# EAGLE design Lipo-Charger-5V-setup_RevC (EAGLE 8.2.1)
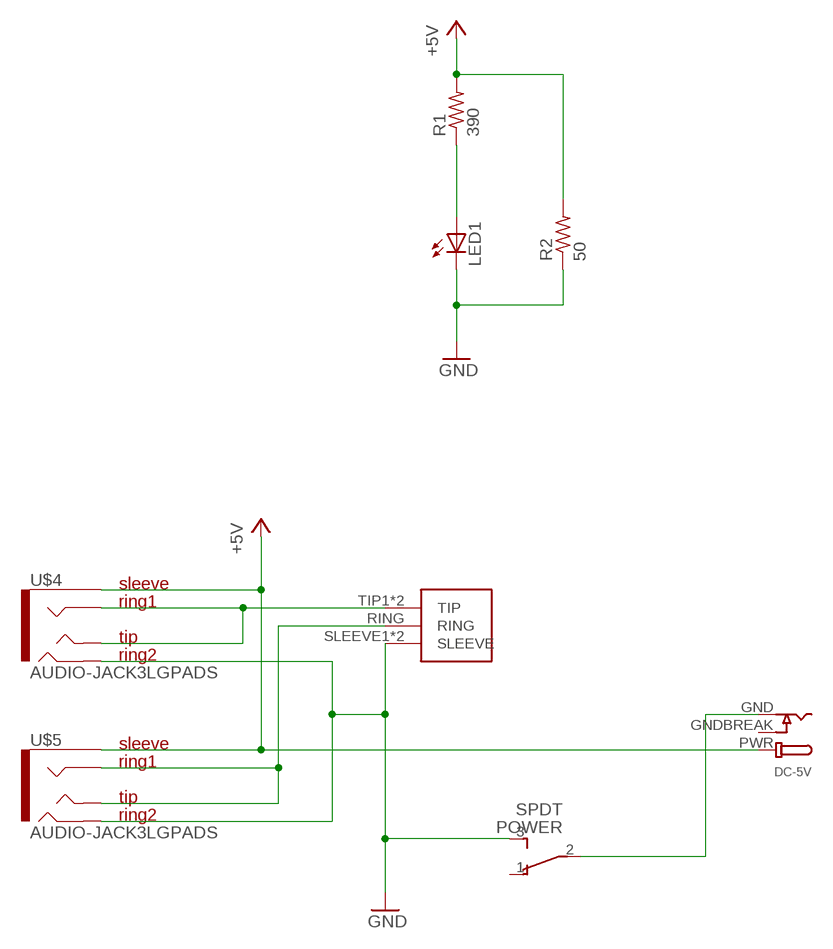
[diagram p0: schematic, sheet 1]

## Parts
AUDIO_OUT  1/8"-F-STEREO-PCB  [1/8"-F-STEREO-PCB]
DC-5V  DCBARRELPTH  [DCJACK_2MM_PTH]
LED1  LED3MM  [LED3MM]
POWER  SPDT  SWITCH_SPDTTE-CONNECT  [SWITCH_SPDT-TE-CONNECT]
R1  390  R-US_0204/7  [0204/7]
R2  50  R-US_0204/7  [0204/7]
U$4  AUDIO-JACK3LGPADS  [AUDIO-JACK-TRRS-SMD]
U$5  AUDIO-JACK3LGPADS  [AUDIO-JACK-TRRS-SMD]

## Nets
+5V: DC-5V.PWR R1.2 R2.2 U$4.EARTH U$5.EARTH
GND: AUDIO_OUT.SLEEVE1(SLEEVE) AUDIO_OUT.SLEEVE2(SLEEVE) LED1.K(C) POWER.3 R2.1 U$4.RING2 U$5.RING2
N$2: LED1.A R1.1
N$4: DC-5V.GND POWER.2
N$8: AUDIO_OUT.RING U$5.RING1 U$5.TIP
OUT2: AUDIO_OUT.TIP1(TIP) AUDIO_OUT.TIP2(TIP) U$4.RING1 U$4.TIP
Unconnected: POWER.1

## Power pins joined to a net without a drawn wire
GNDBREAK: DC-5V.GNDBREAK

## Library data of the parts
AUDIO_OUT = CMU-ArtFab:1/8"-F-STEREO-PCB
DC-5V = microbuilder:DCBARREL: DC Barrel Jack DCJACK_1.3MM_PTH - Through Hole 1.3mm Jack (4UConnector: 05536) DCJACK_2MM_PTH - Through Hole 2.0/2.1 Jack (4UConnector: 05537) DCJACK_2MM_SMT - SMT 2.0/2.1mm Jack(4UConnector: 03267)
LED1 = led:LED: LED OSRAM: - CHIPLED LG R971, LG N971, LY N971, LG Q971, LY Q971, LO R971, LY R971 LH N974, LH R974 LS Q976, LO Q976, LY Q976 LO Q996 - Hyper CHIPLED LW Q18S LB Q993, LB Q99A, LB R99A - SideLED LS A670, LO A670, LY A670, LG A670, LP A670 LB A673, LV A673, LT A673, LW A673 LH A674 LY A675 LS A676, LA A676, LO A676, LY A676, LW A676 LS A679, LY A679, LG A679 - Hyper Micro SIDELED® LS Y876, LA Y876, LO Y876, LY Y876 LT Y87S - SmartLED LW L88C, LW L88S LB L89C, LB L89S, LG L890 LS L89K, LO L89K, LY L89K LS L896, LA L896, LO L896, LY L896 - TOPLED LS T670, LO T670, LY T670, LG T670, LP T670 LSG T670, LSP T670, LSY T670, LOP T670, LYG T670 LG T671, LOG T671, LSG T671 LB T673, LV T673, LT T673, LW T673 LH T674 LS T676, LA T676, LO T676, LY T676, LB T676, LH T676, LSB T676, LW T676 LB T67C, LV T67C, LT T67C, LS T67K, LO T67K, LY T67K, LW E67C LS E67B, LA E67B, LO E67B, LY E67B, LB E67C, LV E67C, LT E67C LW T67C LS T679, LY T679, LG T679 LS T770, LO T770, LY T770, LG T770, LP T770 LB T773, LV T773, LT T773, LW T773 LH T774 LS E675, LA E675, LY E675, LS T675 LS T776, LA T776, LO T776, LY T776, LB T776 LHGB T686 LT T68C, LB T68C - Hyper Mini TOPLED® LB M676 - Mini TOPLED Santana® LG M470 LS M47K, LO M47K, LY M47K Source: http://www.osram.convergy.de LUXEON: - LUMILED® LXK2-PW12-R00, LXK2-PW12-S00, LXK2-PW14-U00, LXK2-PW14-V00 LXK2-PM12-R00, LXK2-PM12-S00, LXK2-PM14-U00 LXK2-PE12-Q00, LXK2-PE12-R00, LXK2-PE12-S00, LXK2-PE14-T00, LXK2-PE14-U00 LXK2-PB12-K00, LXK2-PB12-L00, LXK2-PB12-M00, LXK2-PB14-N00, LXK2-PB14-P00, LXK2-PB14-Q00 LXK2-PR12-L00, LXK2-PR12-M00, LXK2-PR14-Q00, LXK2-PR14-R00 LXK2-PD12-Q00, LXK2-PD12-R00, LXK2-PD12-S00 LXK2-PH12-R00, LXK2-PH12-S00 LXK2-PL12-P00, LXK2-PL12-Q00, LXK2-PL12-R00 Source: www.luxeon.com KINGBRIGHT: KA-3528ASYC Source: www.kingbright.com
POWER = CMU-ArtFab:SWITCH_SPDT
R1 R2 = CMU-ArtFab:R-US_: RESISTOR, American symbol
U$4 U$5 = CMU-ArtFab:AUDIO-JACK3: Audio jack - 3.5mm TRRS variety - two rings.

## Board
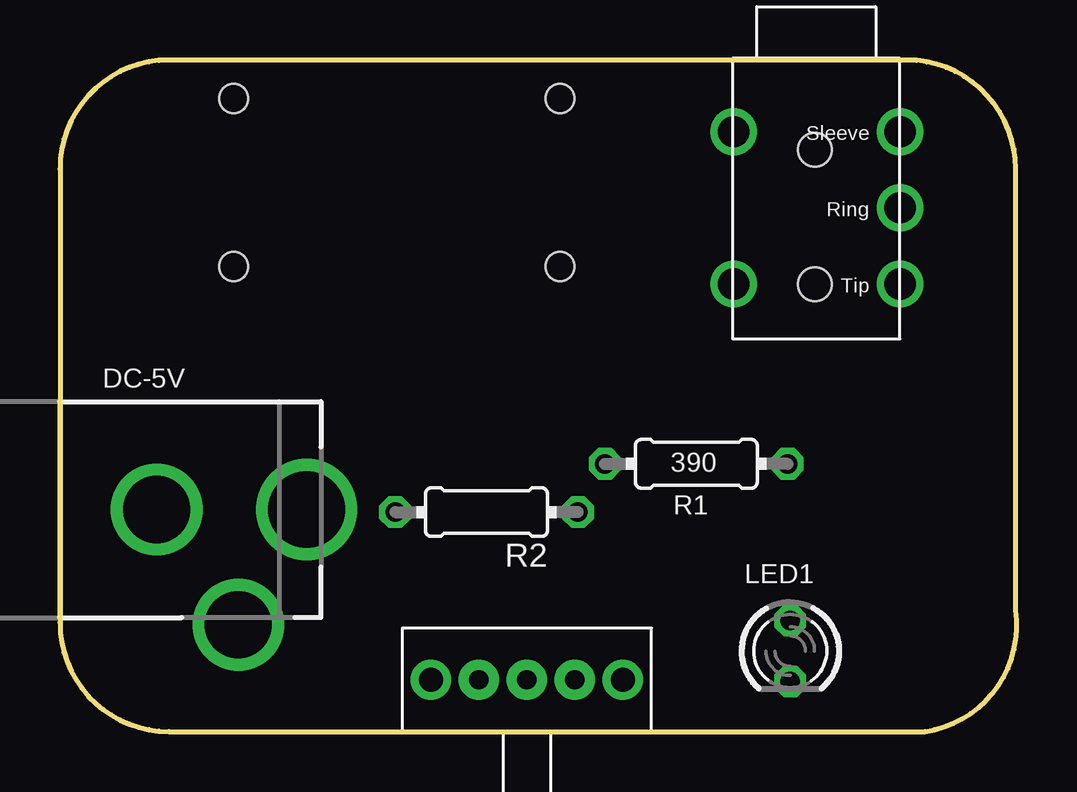
[diagram p1: board, top side]
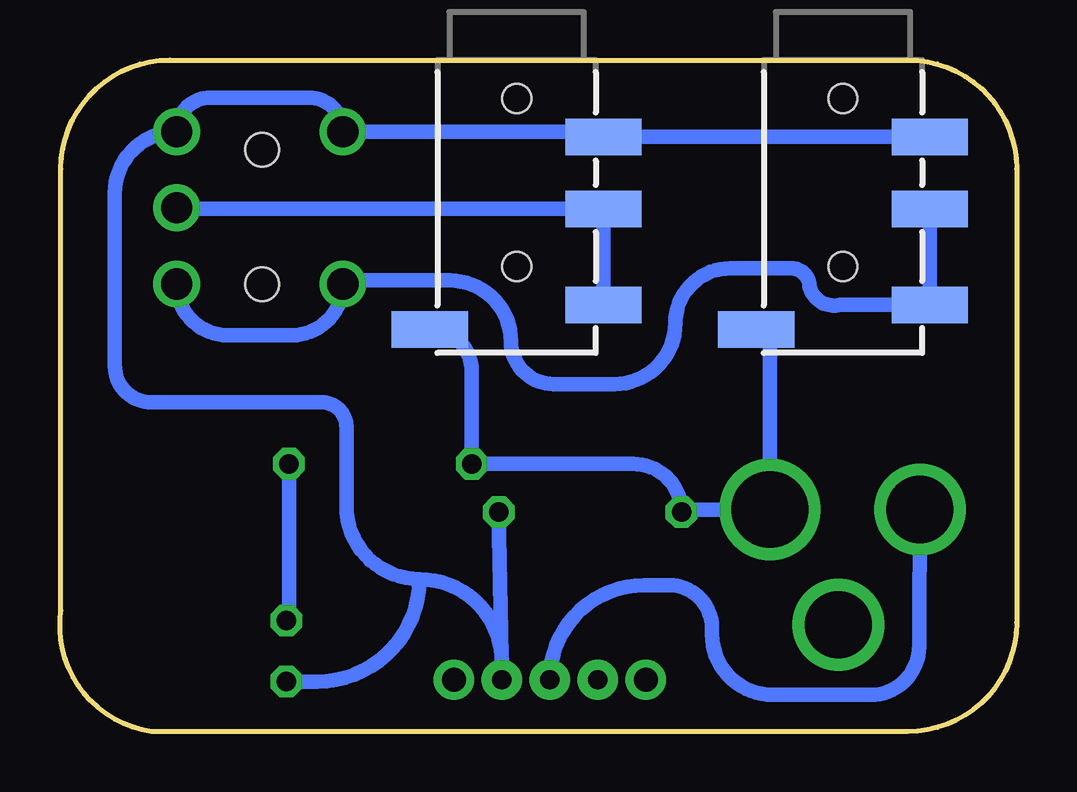
[diagram p2: board, bottom side, seen from below]

Size 39.88 x 27.98 mm. Coordinates in mm from the lower left corner, seen from the top.
Outline: 0,4.54 arc90 4.54,0 36.06,0 arc90 39.84,5.05 39.84,23.44 arc90 35.3,27.98 4.54,27.98 arc90 0,23.44 0,4.54
Copper layers (1*16): Top 0.035mm / dielectric 1.5mm / Bottom 0.035mm
Design rules "default *": minimum track width 10mil, minimum drill 24mil, track to track 10mil, track to pad 10mil, pad to pad 10mil, via to via 10mil, smd to smd 8mil, copper to edge 40mil, drill to drill 8mil, minimum pad ring 10mil, minimum via ring 8mil, stop-mask expansion 4mil, vias tented up to drill 0mil, thermal gap 10mil

### Footprints (pad centres in the part's own frame; a part is rotated, then mirrored left to right if it is on the bottom)
1/8"-F-STEREO-PCB = drill 1.3: RING 5.461,0; SLEEVE1 8.636,6.934; SLEEVE2 8.636,0; TIP1 2.286,6.934; TIP2 2.286,0 | hole 1.4: 2.286,3.556; 7.874,3.556
DCJACK_2MM_PTH = drill 2.8: GND 0,7.35; GNDBREAK 4.8,10.75 | drill 3.2: PWR 0,13.6
LED3MM = drill 0.813 octagon: A -1.27,0; K 1.27,0
SWITCH_SPDT-TE-CONNECT = drill 0.8 pad 1.676: 1 2,0; 2 4,0; 3 6,0 | drill 1 pad 1.676: MOUNT1 0,0; MOUNT2 8,0
0204/7 = drill 0.813 octagon: 1 -3.81,0; 2 3.81,0
AUDIO-JACK-TRRS-SMD = smd 1.524 x 3.175: EARTH 11.227,-3.619; RING1 6.2,3.619; RING2 3.2,3.619; TIP 10.2,3.619 | hole 1.2: 1.6,0; 8.6,0

### Placement (x,y rotation side)
AUDIO_OUT  35.02,16.36 90 top
DC-5V  -3.32,9.25 270 top
LED1  30.44,3.35 270 top
POWER  15.46,2.16 0 top
R1  26.52,11.16 180 top
R2  17.78,9.14 180 top
U$4  7.24,27.98 270 bottom
U$5  20.84,27.98 270 bottom

### Tracks (layer width: path | path; a pad name or v marks a point on that pad's centre or on a via)
+5V
  Bottom 0.61: U$5.EARTH arc90 22.71,15.01 R1.2 15.98,11.16 arc90 R2.2 arc90 13.86,9.25 DC-5V.PWR 10.28,16.18 arc-90 U$4.EARTH
GND
  Bottom 0.61: 24.89,6.35 arc90 27.94,9.4 27.94,12.7 arc-90 28.96,13.72 36.07,13.72 arc90 37.59,15.24 37.59,22.42 arc90 AUDIO_OUT.SLEEVE2 arc90 33.6,26.42 29.5,26.42 arc90 AUDIO_OUT.SLEEVE1 17.44,25 arc90 U$5.RING2 U$4.RING2 | 24.89,6.35 arc90 21.46,2.92 POWER.3 R2.1 | LED1.K 29.16,2.08 arc-90 24.89,6.35
N$2
  Bottom 0.61: R1.1 30.33,4.73 arc90 LED1.A
N$4
  Bottom 0.61: DC-5V.GND 4.06,4.06 4.06,3.56 arc90 6.1,1.52 10.16,1.52 arc90 12.7,4.06 12.7,4.32 arc-90 14.48,6.1 15.52,6.1 arc-90 POWER.2
N$8
  Bottom 0.61: U$5.TIP U$5.RING1 34.98,21.78 arc90 AUDIO_OUT.RING
OUT2
  Bottom 0.61: U$4.RING1 U$4.TIP 7.37,17.78 arc90 8.64,18.54 arc-90 9.4,19.3 11.94,19.3 arc-90 14.22,17.02 arc90 16.76,14.48 19.3,14.48 arc90 21.08,16.26 arc-90 23.62,18.8 27.94,18.8 arc-90 AUDIO_OUT.TIP1 arc90 30.22,16.51 32.88,16.51 arc90 AUDIO_OUT.TIP2